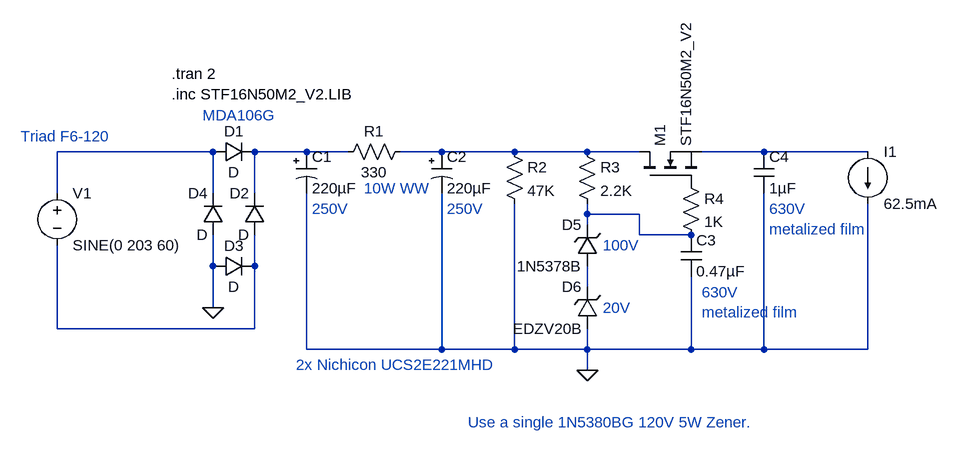
[diagram p0: schematic ScreenSupply.asc]
ScreenSupply.asc, the LTspice schematic file:
Version 4
SHEET 1 1996 1392
WIRE -144 64 -384 64
WIRE 0 64 -80 64
WIRE 64 64 0 64
WIRE 208 64 144 64
WIRE 320 64 208 64
WIRE 432 64 320 64
WIRE 512 64 432 64
WIRE 704 64 608 64
WIRE 864 64 704 64
WIRE -384 128 -384 64
WIRE -144 128 -144 64
WIRE -80 128 -80 64
WIRE 432 160 432 144
WIRE 512 160 432 160
WIRE 432 176 432 160
WIRE 512 192 512 160
WIRE 592 192 512 192
WIRE -144 240 -144 192
WIRE -80 240 -80 192
WIRE 432 272 432 240
WIRE -144 304 -144 240
WIRE -384 336 -384 208
WIRE -80 336 -80 240
WIRE -80 336 -384 336
WIRE 0 368 0 128
WIRE 208 368 208 128
WIRE 208 368 0 368
WIRE 320 368 320 144
WIRE 320 368 208 368
WIRE 432 368 432 336
WIRE 432 368 320 368
WIRE 592 368 592 256
WIRE 592 368 432 368
WIRE 704 368 704 128
WIRE 704 368 592 368
WIRE 864 368 864 144
WIRE 864 368 704 368
WIRE 432 400 432 368
FLAG -144 304 0
FLAG 432 400 0
SYMBOL nmos 512 112 R270
SYMATTR InstName M1
SYMATTR Value STF16N50M2_V2
SYMATTR Prefix X
SYMBOL voltage -384 112 R0
SYMATTR InstName V1
SYMATTR Value SINE(0 203 60)
SYMBOL diode -144 80 R270
WINDOW 0 32 32 VTop 2
WINDOW 3 0 32 VBottom 2
SYMATTR InstName D1
SYMBOL diode -64 192 R180
WINDOW 0 24 64 Left 2
WINDOW 3 24 0 Left 2
SYMATTR InstName D2
SYMBOL diode -144 256 R270
WINDOW 0 32 32 VTop 2
WINDOW 3 0 32 VBottom 2
SYMATTR InstName D3
SYMBOL diode -128 192 R180
WINDOW 0 24 64 Left 2
WINDOW 3 24 0 Left 2
SYMATTR InstName D4
SYMBOL polcap -16 64 R0
SYMATTR InstName C1
SYMATTR Value 220µF
SYMBOL polcap 192 64 R0
SYMATTR InstName C2
SYMATTR Value 220µF
SYMBOL res 160 48 R90
WINDOW 0 0 56 VBottom 2
WINDOW 3 32 56 VTop 2
SYMATTR InstName R1
SYMATTR Value 330
SYMBOL res 304 48 R0
SYMATTR InstName R2
SYMATTR Value 47K
SYMBOL res 416 48 R0
SYMATTR InstName R3
SYMATTR Value 2.2K
SYMBOL zener 448 240 R180
WINDOW 0 24 64 Left 2
WINDOW 3 24 0 Left 2
SYMATTR InstName D5
SYMATTR Value 1N5378B
SYMATTR Description Diode
SYMATTR Type diode
SYMBOL zener 448 336 R180
WINDOW 0 24 64 Left 2
WINDOW 3 24 0 Left 2
SYMATTR InstName D6
SYMATTR Value EDZV20B
SYMATTR Description Diode
SYMATTR Type diode
SYMBOL res 576 96 R0
SYMATTR InstName R4
SYMATTR Value 1K
SYMBOL cap 576 192 R0
SYMATTR InstName C3
SYMATTR Value 0.47µF
SYMBOL cap 688 64 R0
SYMATTR InstName C4
SYMATTR Value 1µF
SYMBOL current 864 64 R0
SYMATTR InstName I1
SYMATTR Value 62.5mA
TEXT -208 -56 Left 2 !.tran 2\n.inc STF16N50M2_V2.LIB
TEXT 456 208 Left 2 ;100V
TEXT 456 304 Left 2 ;20V
TEXT -440 40 Left 2 ;Triad F6-120
TEXT -160 8 Left 2 ;MDA106G
TEXT 248 480 Left 2 ;Use a single 1N5380BG 120V 5W Zener.
TEXT 608 280 Left 2 ;630V\nmetalized film
TEXT 712 152 Left 2 ;630V\nmetalized film
TEXT 88 120 Left 2 ;10W WW
TEXT -16 392 Left 2 ;2x Nichicon UCS2E221MHD
TEXT 8 152 Left 2 ;250V
TEXT 216 152 Left 2 ;250V

The netlist it stands for:
* ScreenSupply.asc
XM1 N003 P001 N004 STF16N50M2_V2  ; pins D G S
V1 N001 N006 SINE(0 203 60)
D1 N001 N002 D
D2 N006 N002 D
D3 0 N006 D
D4 0 N001 D
C1 N002 0 220µF
C2 N003 0 220µF
R1 N003 N002 330
R2 N003 0 47K
R3 N003 N005 2.2K
D5 N007 N005 1N5378B
D6 0 N007 EDZV20B
R4 P001 N005 1K
C3 N005 0 0.47µF
C4 N004 0 1µF
I1 N004 0 62.5mA
.model D D
.lib standard.dio
.tran 2
.inc STF16N50M2_V2.LIB
* 100V
* 20V
* Triad F6-120
* MDA106G
* Use a single 1N5380BG 120V 5W Zener.
* 630V
* metalized film
* 630V
* metalized film
* 10W WW
* 2x Nichicon UCS2E221MHD
* 250V
* 250V
.backanno
.end